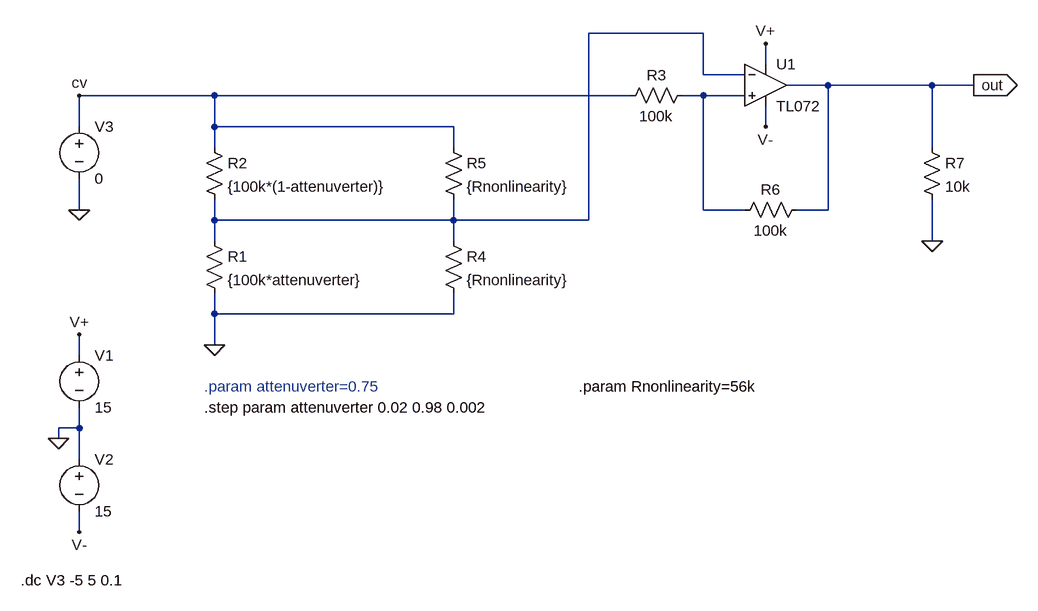
[diagram p0: schematic 2023-01-11 Attenuverter.asc]
2023-01-11 Attenuverter.asc, the LTspice schematic file:
Version 4
SHEET 1 1520 680
WIRE 928 -432 752 -432
WIRE 1024 -384 1024 -416
WIRE 928 -368 928 -432
WIRE 992 -368 928 -368
WIRE 1120 -352 1056 -352
WIRE 1280 -352 1120 -352
WIRE 1344 -352 1280 -352
WIRE 176 -336 -32 -336
WIRE 816 -336 176 -336
WIRE 928 -336 896 -336
WIRE 992 -336 928 -336
WIRE -32 -288 -32 -336
WIRE 176 -288 176 -336
WIRE 544 -288 176 -288
WIRE 1024 -288 1024 -320
WIRE 176 -256 176 -288
WIRE 544 -256 544 -288
WIRE 1280 -256 1280 -352
WIRE -32 -160 -32 -208
WIRE 928 -160 928 -336
WIRE 992 -160 928 -160
WIRE 1120 -160 1120 -352
WIRE 1120 -160 1072 -160
WIRE 176 -144 176 -176
WIRE 544 -144 544 -176
WIRE 544 -144 176 -144
WIRE 752 -144 752 -432
WIRE 752 -144 544 -144
WIRE 176 -112 176 -144
WIRE 544 -112 544 -144
WIRE 1280 -112 1280 -176
WIRE 176 0 176 -32
WIRE 544 0 544 -32
WIRE 544 0 176 0
WIRE 176 48 176 0
WIRE -32 64 -32 32
WIRE -32 176 -32 144
WIRE -32 176 -64 176
WIRE -64 192 -64 176
WIRE -32 224 -32 176
WIRE -32 336 -32 304
FLAG -32 32 V+
FLAG -32 336 V-
FLAG -64 192 0
FLAG -32 -160 0
FLAG 1024 -416 V+
FLAG 1024 -288 V-
FLAG 176 48 0
FLAG -32 -336 cv
FLAG 1280 -112 0
FLAG 1344 -352 out
IOPIN 1344 -352 Out
SYMBOL voltage -32 48 R0
WINDOW 123 0 0 Left 0
WINDOW 39 0 0 Left 0
SYMATTR InstName V1
SYMATTR Value 15
SYMBOL voltage -32 208 R0
WINDOW 123 0 0 Left 0
WINDOW 39 0 0 Left 0
SYMATTR InstName V2
SYMATTR Value 15
SYMBOL voltage -32 -304 R0
WINDOW 123 0 0 Left 0
WINDOW 39 0 0 Left 0
SYMATTR InstName V3
SYMATTR Value 0
SYMBOL AutoGenerated\\TL072 1024 -352 R0
SYMATTR InstName U1
SYMBOL res 160 -128 R0
SYMATTR InstName R1
SYMATTR Value {100k*attenuverter}
SYMBOL res 160 -272 R0
SYMATTR InstName R2
SYMATTR Value {100k*(1-attenuverter)}
SYMBOL res 912 -352 R90
WINDOW 0 0 56 VBottom 2
WINDOW 3 32 56 VTop 2
SYMATTR InstName R3
SYMATTR Value 100k
SYMBOL res 528 -128 R0
SYMATTR InstName R4
SYMATTR Value {Rnonlinearity}
SYMBOL res 528 -272 R0
SYMATTR InstName R5
SYMATTR Value {Rnonlinearity}
SYMBOL res 1088 -176 R90
WINDOW 0 0 56 VBottom 2
WINDOW 3 32 56 VTop 2
SYMATTR InstName R6
SYMATTR Value 100k
SYMBOL res 1264 -272 R0
SYMATTR InstName R7
SYMATTR Value 10k
TEXT 160 112 Left 2 ;.param attenuverter=0.75
TEXT 160 144 Left 2 !.step param attenuverter 0.02 0.98 0.002
TEXT 736 112 Left 2 !.param Rnonlinearity=56k
TEXT -122 410 Left 2 !.dc V3 -5 5 0.1

The netlist it stands for:
* 2023-01-11 Attenuverter.asc
V1 V+ 0 15
V2 0 V- 15
V3 cv 0 0
* U1: TL072 (symbol AutoGenerated\TL072 not available, pins judged from their places): In+=N002 In-=N001 V+=V+ V-=V- OUT=out
R1 N001 0 {100k*attenuverter}
R2 cv N001 {100k*(1-attenuverter)}
R3 N002 cv 100k
R4 N001 0 {Rnonlinearity}
R5 cv N001 {Rnonlinearity}
R6 out N002 100k
R7 out 0 10k
* .param attenuverter=0.75
.step param attenuverter 0.02 0.98 0.002
.param Rnonlinearity=56k
.dc V3 -5 5 0.1
.backanno
.end